# EAGLE schematic remote (EAGLE 6.6.0)
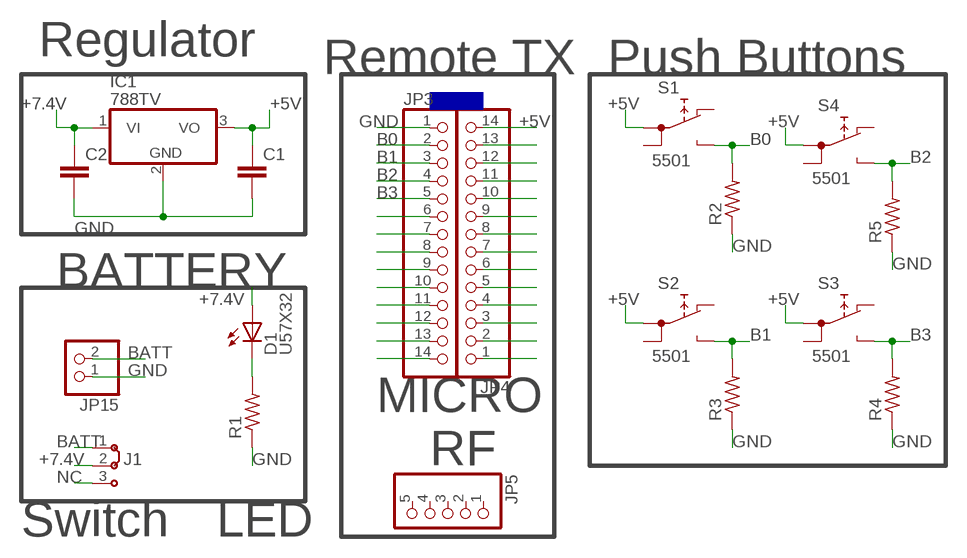
[diagram p0: schematic, sheet 1]

## Parts
C1  C2,5-3  [C2.5-3]
C2  C2,5-3  [C2.5-3]
D1  U57X32  [U57X32]
IC1  788TV  [TO220V]
J1  J2X2MM  [04C]
JP3  PINHD-1X14  [1X14]
JP4  PINHD-1X14  [1X14]
JP5  PINHD-1X5  [1X05]
JP15  PINHD-1X2  [1X02]
R1  R-US_0204/2V  [0204V]
R2  R-US_0204/2V  [0204V]
R3  R-US_0204/2V  [0204V]
R4  R-US_0204/2V  [0204V]
R5  R-US_0204/2V  [0204V]
S1  5501  [5501]
S2  5501  [5501]
S3  5501  [5501]
S4  5501  [5501]

## Nets
+5V: C1.1 IC1.3(VO) JP4.14 S1.1A S2.1A S3.1A S4.1A
+7.4V: C2.1 D1.A IC1.1(VI) J1.2
B0: JP3.2 R2.2 S1.NO
B1: JP3.3 R3.2 S2.NO
B2: JP3.4 R5.2 S4.NO
B3: JP3.5 R4.2 S3.NO
BATT: J1.1 JP15.2
D0: JP3.7
D1: JP3.8
D2: JP3.9
GND: C1.2 C2.2 IC1.2(GND) JP3.1 JP15.1 R1.1 R2.1 R3.1 R4.1 R5.1
N$1: D1.K(C) R1.2
N$10: JP3.6
N$20: JP3.10
N$21: JP3.11
N$22: JP3.12
N$23: JP3.13
N$24: JP3.14
N$26: JP4.13
N$27: JP4.12
N$28: JP4.11
N$29: JP4.10
N$30: JP4.9
N$31: JP4.8
N$32: JP4.7
N$33: JP4.6
N$34: JP4.5
N$35: JP4.4
N$36: JP4.3
N$37: JP4.2
N$38: JP4.1
NC: J1.3
Unconnected: JP5.1 JP5.2 JP5.3 JP5.4 JP5.5 S1.1B S1.NC S2.1B S2.NC S3.1B S3.NC S4.1B S4.NC

## Notes on the sheet
- Regulator
- Remote TX | Push Buttons
- BATTERY
- MICRO
- RF
- Switch | LED

## Library data of the parts
C1 C2 = capacitor-wima:C: CAPACITOR naming: grid - package width
D1 = led:U57X32: LED rectangle, 5.7 x 3.2 mm
IC1 = linear:78*: Positive VOLTAGE REGULATOR Source: http://cache.national.com/ds/LM/LM78L05.pdf http://www.fairchildsemi.com/ds/LM/LM7805.pdf
J1 = jumper:J2: Jumper switch 2 x 2.5 mm
JP3 JP4 = pinhead:PINHD-1X14: PIN HEADER
JP5 = pinhead:PINHD-1X5: PIN HEADER
JP15 = pinhead:PINHD-1X2: PIN HEADER
R1-R5 = resistor:R-US_: RESISTOR, American symbol
S1-S4 = switch:55?: PUSHBUTTON SERIES 5500 SWITCHES Source: www.e-switch.com .. 5500.pdf